# Altium schematic sheet protect2.SchDoc
size A4
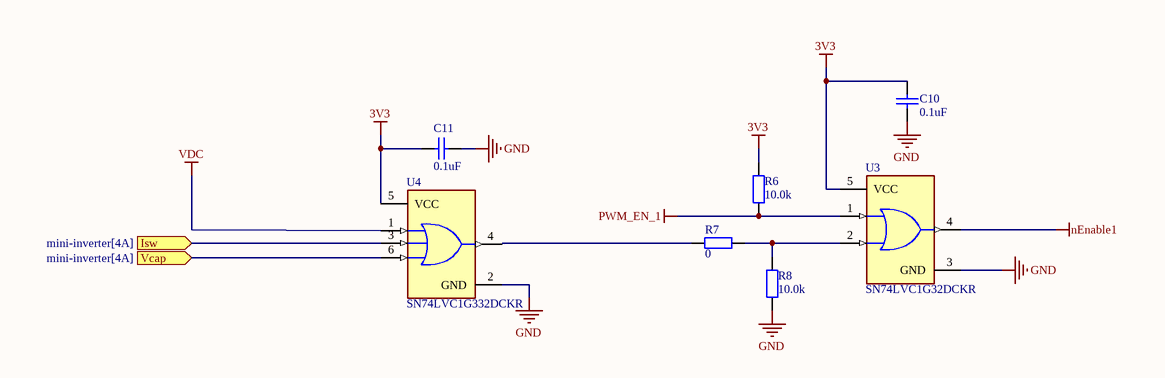
[diagram p0: protect2.SchDoc]

## Parts
C10  0.1uF  [CAPC1608X06N]
C11  0.1uF  [CAPC1608X06N]
R6  10.0k  [RESC1608X05N]
R7  0  [RESC1608X05N]
R8  10.0k  [RESC1608X05N]
U3  SN74LVC1G32DCKR  [FP-DCK0005A-IPC_A]
U4  SN74LVC1G332DCKR  [FP-DCK0006A-MFG]

## Ports
Isw (in, see mini-inverter[4A]), Vcap (in, see mini-inverter[4A])

## Nets
3V3: C10.1 C11.1 R6.1 U3.5(VCC)
GND: C10.2 C11.2 R8.1 U3.3(GND) U4.2(GND)
nEnable1: U3.4(Y)
PWM_EN_1: R6.2 U3.1(A)
VDC: U4.1(A)
Isw: U4.3(B) ; port Isw
Vcap: U4.6(C) ; port Vcap
NetR7_2: R7.2 R8.2 U3.2(B)

Not connected (* = marked no-connect by the designer): R7 1; U4 4(Y) 5(VCC)

## Library data of the parts
C10 C11 = Cap: Capacitor; Published: 8-Jun-2000; LatestRevisionDate: 17-Jul-2002; LatestRevisionNote: Re-released for DXP Platform.; PackageReference: RAD-0.3; Publisher: Altium Limited; PackageDescription: Radial Cap, Thru-Hole; 2 Leads; 0.3 in Pin Spacing; Value: 0.1uF
R6-R8 = 0603 100KΩ (1003) 1%_4: 贴片电阻; Value: 1MΩ(1%); ComponentLink1Description: 供应商链接; ComponentLink1URL: http://www.szlcsc.com/product/details_26546.html; Package: 0603; Supplier: LC; SuppliersPartNumber: C25803
U3 = CMP-0859-00376-4: IC GATE OR 1CH 2-INP SC70-5; Turn-On Delay Time: 4.5ns; Schmitt Trigger Input: No; Number of Bits: 1; High Level Output Current: -32mA; Max Supply Voltage: 5.5V; Propagation Delay: 4ns; Max Output Current: 32mA; Min Supply Voltage: 1.65V; Number of Input Lines: 2; Quiescent Current: 10uA; Case/Package: SC; Weight: 8.8E-05oz; Logic Function: OR; Package Quantity: 1; Packaging: Tape and Reel; Mount: Surface Mount; Max Operating Temperature: 125°C; Output Current: 32mA; Length: 2mm; Contact Plating: Gold; Number of Output Lines: 1; Height: 0.9mm; Number of Pins: 5; Width: 1.25mm; REACH SVHC: No SVHC; Number of Circuits: 1; Radiation Hardening: No; Number of Elements: 1; Low Level Output Current: 32mA; Number of Outputs: 1; Min Operating Temperature: -40°C; Number of Inputs: 2; Lead Free: Lead Free; Termination: SMD/SMT; Number of Gates: 1
U4 = CMP-0859-00464-4: IC GATE OR 1CH 3-INP SC70-6; Manufacturer: Texas Instruments; Min Supply Voltage: 1.65V; Number Of Circuits: 1; Nominal Supply Current: 10uA; Number Of Inputs: 3; Max Supply Voltage: 5.5V; Propagation Delay: 20ns; Standoff Height: 0mm; Logic Function Desc: Non-Inverting; Manufacturer Part Number: SN74LVC1G332DCKR; Automotive: No; Temperature: -40°C to +125°C; Device Class L1: Integrated Circuits (ICs); ComponentLink2URL: http://www.ti.com/lit/ds/symlink/sn74lvc1g332.pdf; RoHS: TRUE; Digikey Description: IC GATE OR 1CH 3-INP SC70-6; Octopart: https://octopart.com/sn74lvc1g332dckr-texas+instruments-464861; Ambient Temperature Range Low: -40°C; Number Of Outputs: 1; Height: 1.1mm; Device Class L2: Logic ICs; Mouser Description: Logic Gates Single 3-Input Pos- OR Gate; ComponentLink2Description: Datasheet; Package: DCK0006A; Temperature Range Low: -40°C; Ambient Temperature Range High: +125°C; Temperature Range High: +125°C; Category: IC; Device Class L3: Logic Gates; Lead Free: Yes